# Altium schematic sheet Phare_Alim.SchDoc
size A4
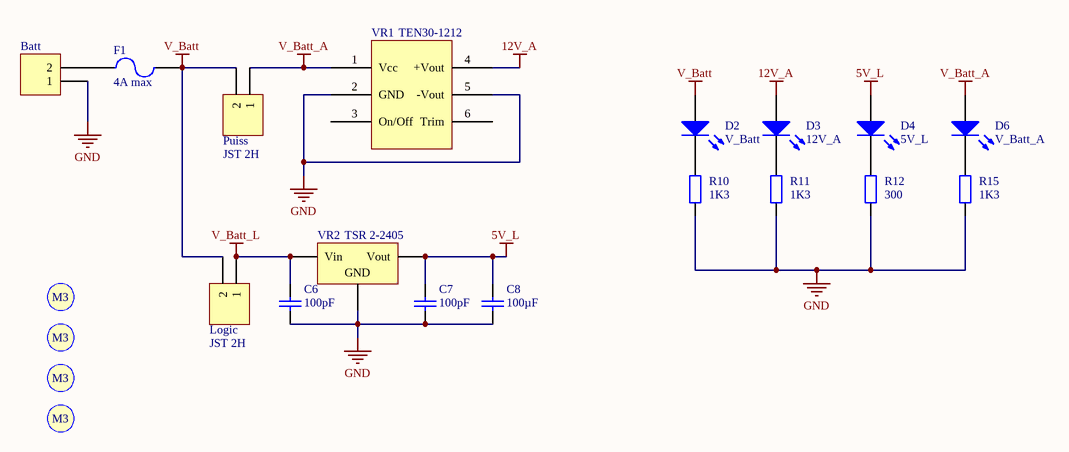
[diagram p0: Phare_Alim.SchDoc]

## Parts
Batt  (no value)  [Battery SALE]
C6  value 100pF  [Capacitor 1206]  (hidden comment: Cap)
C7  value 100pF  [Capacitor 1206]  (hidden comment: Cap)
C8  value 100µF  [Condensateur]  (hidden comment: Cap)
D2  V_Batt  [KP-3216SEC]
D3  12V_A  [KP-3216SEC]
D4  5V_L  [KP-3216SEC]
D6  V_Batt_A  [KP-3216SEC]
F1  4A max  [Fuse]
Logic  JST 2H  [S2B-XH-A]
Puiss  JST 2H  [Molex_MiniFitJr_2x1H]
R10  value 1K3  [Resistor 1206]  (hidden comment: Res2)
R11  value 1K3  [Resistor 1206]  (hidden comment: Res2)
R12  value 300  [Resistor 1206]  (hidden comment: Res2)
R15  value 1K3  [Resistor 1206]  (hidden comment: Res2)
S1  Screw M3  [Screw M3]  (value not drawn)
S2  Screw M3  [Screw M3]  (value not drawn)
S3  Screw M3  [Screw M3]  (value not drawn)
S4  Screw M3  [Screw M3]  (value not drawn)
VR1  TEN30-1212  [TRACO_2x1inch]
VR2  TSR 2-2405  [TRS]

## Nets
5V_L: C7.1 C8.1 D4.1(A) VR2.3(Vout)
12V_A: D3.1(A) VR1.4(+Vout)
GND: Batt.1 C6.2 C7.2 C8.2 R10.1 R11.1 R12.1 R15.1 VR1.2(GND) VR1.5(-Vout) VR2.2(GND)
V_Batt: D2.1(A) F1.2 Logic.2 Puiss.2
V_Batt_A: D6.1(A) Puiss.1 VR1.1(Vcc)
V_Batt_L: C6.1 Logic.1 VR2.1(Vin)
NetBatt_2: Batt.2 F1.1
NetD2_2: D2.2(K) R10.2
NetD3_2: D3.2(K) R11.2
NetD4_2: D4.2(K) R12.2
NetD6_2: D6.2(K) R15.2

Not connected (* = marked no-connect by the designer): VR1 3(On/Off) 6(Trim)

## Notes on the sheet
- (in symbol Screw M3) M3

## Library data of the parts
Batt Logic Puiss = Header 2: Header, 2-Pin; LatestRevisionDate: 17-Jul-2002; LatestRevisionNote: Re-released for DXP Platform.; Publisher: Altium Limited
C6-C8 = Cap: Capacitor; Published: 8-Jun-2000; LatestRevisionDate: 17-Jul-2002; LatestRevisionNote: Re-released for DXP Platform.; PackageReference: RAD-0.3; Publisher: Altium Limited; PackageDescription: Radial Cap, Thru-Hole; 2 Leads; 0.3 in Pin Spacing
D2-D4 D6 = LED2: Typical RED, GREEN, YELLOW, AMBER GaAs LED; Published: 8-Jun-2000; LatestRevisionDate: 17-Jul-2002; LatestRevisionNote: Re-released for DXP Platform.; PackageVersion: Feb-2002; PackageReference: 3.2X1.6X1.1; Publisher: Altium Limited; PackageDescription: SM LED; 2 Flat Leads
F1 = Fuse 2: Fuse; Published: 8-Jun-2000; LatestRevisionDate: 17-Jul-2002; LatestRevisionNote: Re-released for DXP Platform.; PackageReference: PIN-W2/E2.8; Publisher: Altium Limited; PackageDescription: Thru-Hole; 2 Leads
R10-R12 R15 = Res2: Resistor; Published: 8-Jun-2000; LatestRevisionDate: 17-Jul-2002; LatestRevisionNote: Re-released for DXP Platform.; PackageReference: AXIAL-0.4; Publisher: Altium Limited; PackageDescription: Axial Device, Thru-Hole; 2 Leads; 0.4 in Pin Spacing
VR1 = TEN50: TRACO TEN50; LatestRevisionDate: 17-Jul-2002; LatestRevisionNote: Re-released for DXP Platform.; Publisher: Altium Limited
VR2 = Volt Reg: Voltage Regulator; Published: 24-Mar-1999; LatestRevisionDate: 29-May-2009; LatestRevisionNote: IPC-7351 Footprint Added.; PackageReference: D2PAK; Publisher: Altium Limited; PackageDescription: 3-Pin Transistor Outline Package 2.54 mm Pitch, 15.1 mm Lead Span